# Altium schematic sheet Encoder Fin - Quadrature  Channel.SchDoc
size A
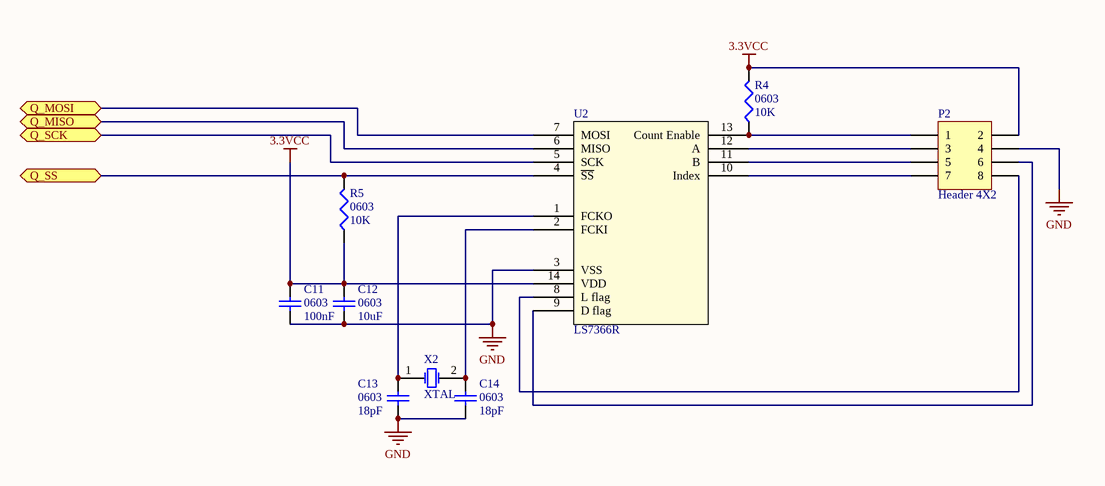
[diagram p0: Encoder Fin - Quadrature  Channel.SchDoc]

## Parts
C11  0603  value 100nF  [1608[0603]]
C12  0603  value 10uF  [1608[0603]]
C13  0603  value 18pF  [1608[0603]]
C14  0603  value 18pF  [1608[0603]]
P2  Header 4X2  [HDR2X4]
R4  0603  value 10K  [J1-0603]
R5  0603  value 10K  [J1-0603]
U2  LS7366R  [SOIC127P630X175-14N]
X2  XTAL  [ABM7-10.0000MHZ-D2Y-T]

## Ports
Q_MISO, Q_MOSI, Q_SCK, Q_SS

## Nets
3.3VCC: C11.2 C12.2 P2.2 R4.2 R5.1 U2.14(VDD)
GND: C11.1 C12.1 C13.1 C14.1 P2.4 U2.3(VSS)
Q_MISO: U2.6(MISO) ; port Q_MISO
Q_MOSI: U2.7(MOSI) ; port Q_MOSI
Q_SCK: U2.5(SCK) ; port Q_SCK
Q_SS: R5.2 U2.4(~{SS}) ; port Q_SS
NetC13_2: C13.2 U2.1(FCKO) X2.1(OSC1)
NetC14_2: C14.2 U2.2(FCKI) X2.2(OSC2)
NetP2_1: P2.1 R4.1 U2.13(Count_Enable)
NetP2_3: P2.3 U2.12(A)
NetP2_5: P2.5 U2.11(B)
NetP2_6: P2.6 U2.9(D_flag)
NetP2_7: P2.7 U2.10(Index)
NetP2_8: P2.8 U2.8(L_flag)

## Library data of the parts
C11-C14 = Cap Semi: Capacitor (Semiconductor SIM Model); Published: 8-Jun-2000; LatestRevisionDate: 29-May-2009; LatestRevisionNote: IPC-7351 Footprint Added.; PackageReference: C1206; Publisher: Altium Limited; PackageDescription: Chip Capacitor
P2 = Header 4X2: Header, 4-Pin, Dual row; LatestRevisionDate: 17-Jul-2002; LatestRevisionNote: Re-released for DXP Platform.; Publisher: Altium Limited
R4 R5 = Res3: Resistor; Published: 8-Jun-2000; LatestRevisionDate: 29-May-2009; LatestRevisionNote: IPC-7351 Footprint Added.; PackageReference: J1-0603; Publisher: Altium Limited; PackageDescription: Chip Resistor
X2 = XTAL: Crystal Oscillator; Published: 8-Jun-2000; LatestRevisionDate: 17-Jul-2002; LatestRevisionNote: Re-released for DXP Platform.; PackageReference: R38; Publisher: Altium Limited; PackageDescription: Crystal, Thru-Hole; 2 Leads; Body 3.1 x 8.2 mm (Dia.xH)